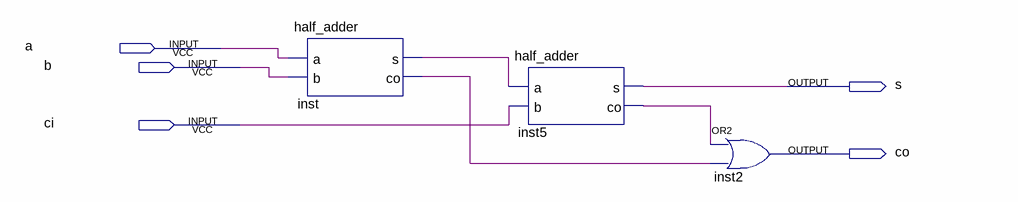
[diagram p0: schematic sheet]
// Quartus schematic full_adder_v.bdf as structural Verilog: 3 symbols, 5 pins
module full_adder_v (
  input  a,
  input  b,
  input  ci,
  output s,
  output co
);

  wire inst5_co, inst_co, inst_s;

  half_adder inst (.a(a), .b(b), .s(inst_s), .co(inst_co));
  half_adder inst5 (.a(inst_s), .b(ci), .s(s), .co(inst5_co));
  or inst2 (co, inst5_co, inst_co);
endmodule
